# Altium project ASR-2DF.PrjPCB
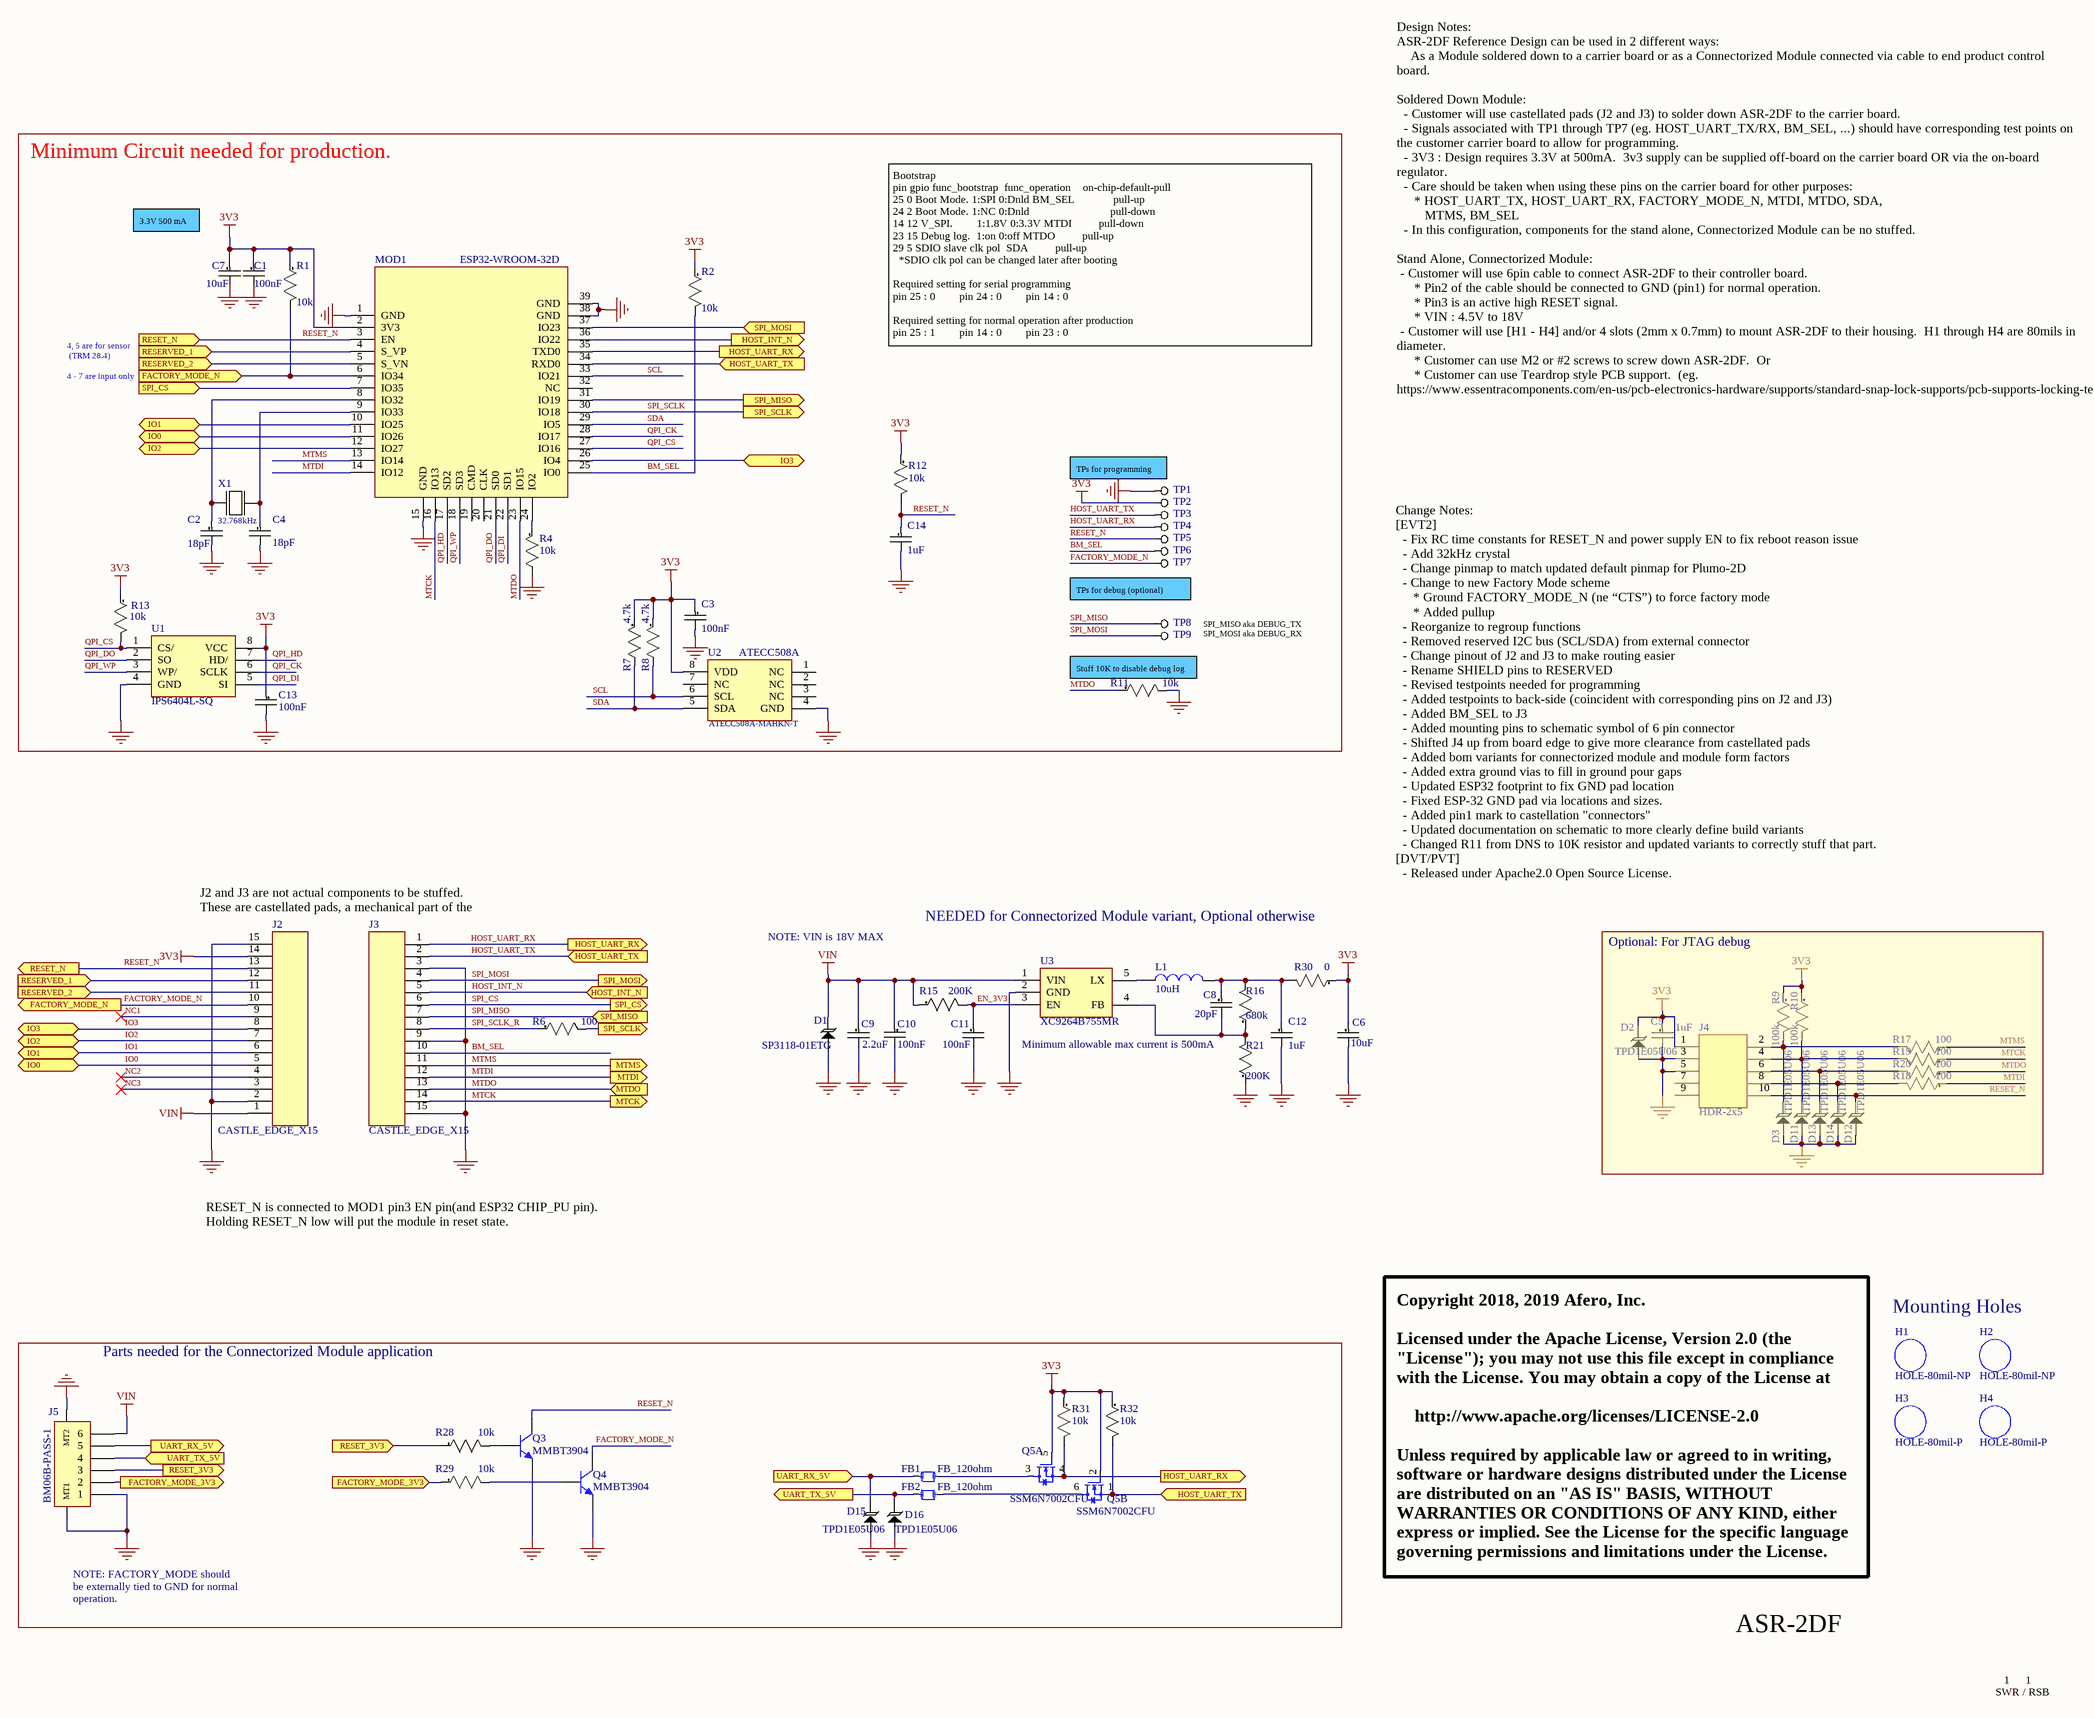
[diagram p0: ASR-2DF.SchDoc]
CompanyName: Afero, Inc.; Revision: PVT
1 sheet, 74 parts. Net scope: flat (ports and power ports of the same name join across sheets).
Board file: ASR-2DF.PcbDoc

## Sheet ASR-2DF.SchDoc
size C; CompanyName: Afero, Inc.; Revision: PVT

### Parts
C1  100nF  [0402C-GENERIC]
C2  18pF  [0402C-GENERIC]
C3  100nF  [0402C-GENERIC]
C4  18pF  [0402C-GENERIC]
C5  1uF  [0402C-GENERIC]
C6  10uF  [0603C-GENERIC]
C7  10uF  [0603C-GENERIC]
C8  20pF  [0402C-GENERIC]
C9  2.2uF  [0603C-GENERIC]
C10  100nF  [0402C-GENERIC]
C11  100nF  [0402C-GENERIC]
C12  1uF  [0402C-GENERIC]
C13  100nF  [0402C-GENERIC]
C14  1uF  [0402C-GENERIC]
D1  SP3118-01ETG  [SOD882]
D2  TPD1E05U06  [SON70P100X45-2N]
D3  TPD1E05U06  [SON70P100X45-2N]
D11  TPD1E05U06  [SON70P100X45-2N]
D12  TPD1E05U06  [SON70P100X45-2N]
D13  TPD1E05U06  [SON70P100X45-2N]
D14  TPD1E05U06  [SON70P100X45-2N]
D15  TPD1E05U06  [SON70P100X45-2N]
D16  TPD1E05U06  [SON70P100X45-2N]
FB1  FB_120ohm  [BLM15]
FB2  FB_120ohm  [BLM15]
H1  HOLE-80mil-NP  [HOLE-80mil-NP]  (no BOM)
H2  HOLE-80mil-NP  [HOLE-80mil-NP]  (no BOM)
H3  HOLE-80mil-P  [HOLE-80mil-P]  (no BOM)
H4  HOLE-80mil-P  [HOLE-80mil-P]  (no BOM)
J2  CASTLE_EDGE_X15  [CASTL-1X15]  (no BOM)
J3  CASTLE_EDGE_X15  [CASTL-1X15]  (no BOM)
J4  HDR-2x5  [S9015E-05]
J5  BM06B-PASS-1  [BM06B-PASS-1]
L1  10uH  [ASPI-0315FS]
MOD1  ESP32-WROOM-32D  [ESP32-WROOM-32D]
Q3  MMBT3904  [sot23]
Q4  MMBT3904  [sot23]
Q5  SSM6N7002CFU  [SOT363]  (parts A,B of 2)
R1  10k  [0402R-GENERIC]
R2  10k  [0402R-GENERIC]
R4  10k  [0402R-GENERIC]
R6  100  [0402R-GENERIC]
R7  4.7k  [0402R-GENERIC]
R8  4.7k  [0402R-GENERIC]
R9  100k  [0402R-GENERIC]
R10  100k  [0402R-GENERIC]
R11  10k  [0402R-GENERIC]
R12  10k  [0402R-GENERIC]
R13  10k  [0402R-GENERIC]
R15  200K  [0402R-GENERIC]
R16  680k  [0402R-GENERIC]
R17  100  [0402R-GENERIC]
R18  100  [0402R-GENERIC]
R19  100  [0402R-GENERIC]
R20  100  [0402R-GENERIC]
R21  200K  [0402R-GENERIC]
R28  10k  [0402R-GENERIC]
R29  10k  [0402R-GENERIC]
R30  0  [0402R-GENERIC]
R31  10k  [0402R-GENERIC]
R32  10k  [0402R-GENERIC]
TP1  TP1MM  [TP1MM]  (value not drawn)  (no BOM)
TP2  TP1MM  [TP1MM]  (value not drawn)  (no BOM)
TP3  TP1MM  [TP1MM]  (value not drawn)  (no BOM)
TP4  TP1MM  [TP1MM]  (value not drawn)  (no BOM)
TP5  TP1MM  [TP1MM]  (value not drawn)  (no BOM)
TP6  TP1MM  [TP1MM]  (value not drawn)  (no BOM)
TP7  TP1MM  [TP1MM]  (value not drawn)  (no BOM)
TP8  TP1MM  [TP1MM]  (value not drawn)  (no BOM)
TP9  TP1MM  [TP1MM]  (value not drawn)  (no BOM)
U1  IPS6404L-SQ  [IPUS.PSRAM]
U2  ATECC508A  Manufacturer Part Number: ATECC508A-MAHKN-T  [SON50P300X60-8N]
U3  XC9264B755MR  [SOT95P275X130-5N]
X1  32.768kHz  [ABS06]

### Blocks framed on the sheet
Minimum Circuit needed for production.: C1-C4 C7 C13 C14 MOD1 R1 R2 R4 R7 R8 R11-R13 TP1-TP9 U1 U2 X1
Optional: For JTAG debug: C5 D2 D3 D11-D14 J4 R9 R10 R17-R20
Parts needed for the Connectorized Module application: D15 D16 FB1 FB2 J5 Q3-Q5 R28 R29 R31 R32

### Ports
FACTORY_MODE_3V3, FACTORY_MODE_N, HOST_INT_N, HOST_UART_RX, HOST_UART_TX, IO0 (bidir), IO1 (bidir), IO2 (bidir), IO3 (bidir), MTCK, MTDI, MTDO, MTMS, RESERVED_1, RESERVED_2, RESET_3V3, RESET_N, SPI_CS, SPI_MISO, SPI_MISO (out), SPI_MOSI, SPI_MOSI (in), SPI_SCLK (out), UART_RX_5V, UART_TX_5V

### Nets
3V3: C1.1 C3.1 C5.1 C6.1 C7.1 C13.1 D2.1(I/O) J2.14 J4.1 MOD1.2(3V3) Q5.2(G2) Q5.5(G2) R1.1 R2.1 R7.1 R8.1 R9.1 R10.1 R12.1 R13.1 R30.1 R31.1 R32.1 TP2.1 U1.8(VCC) U2.8(VDD)
GND: C1.2 C2.2 C3.2 C4.2 C5.2 C6.2 C7.2 C9.2 C10.2 C11.2 C12.2 C13.2 C14.2 D1.2(GND) D2.2(GND) D3.2(GND) D11.2(GND) D12.2(GND) D13.2(GND) D14.2(GND) D15.2(GND) D16.2(GND) J2.2 J2.15 J3.3 J3.9 J3.15 J4.3 J4.5 J5.1 J5.7(MT1) J5.8(MT2) MOD1.1(GND) MOD1.15(GND) MOD1.38(GND) MOD1.39(GND) Q3.2(E) Q4.2(E) R4.2 R11.2 R21.1 TP1.1 U1.4(GND) U2.4(GND) U3.2(GND)
VIN: C9.1 C10.1 D1.1(I/O) J2.1 J5.6 R15.1 U3.1(VIN)
BM_SEL: J3.10 MOD1.25(IO0) R2.2 TP6.1
EN_3V3: C11.1 R15.2 U3.3(EN)
FACTORY_MODE_N: J2.10 MOD1.6(IO34) Q4.3(C) R1.2 TP7.1 ; port FACTORY_MODE_N
HOST_INT_N: J3.5 MOD1.36(IO22) ; port HOST_INT_N
HOST_UART_RX: J3.1 MOD1.35(TXD0) Q5.4(S2) R31.2 TP4.1 ; port HOST_UART_RX
HOST_UART_TX: J3.2 MOD1.34(RXD0) Q5.1(S2) R32.2 TP3.1 ; port HOST_UART_TX
IO0: J2.5 MOD1.11(IO26) ; port IO0
IO1: J2.6 MOD1.10(IO25) ; port IO1
IO2: J2.7 MOD1.12(IO27) ; port IO2
IO3: J2.8 MOD1.26(IO4) ; port IO3
MTCK: J3.14 MOD1.16(IO13) R19.1 ; port MTCK
MTDI: J3.12 MOD1.14(IO12) R18.1 ; port MTDI
MTDO: J3.13 MOD1.23(IO15) R11.1 R20.1 ; port MTDO
MTMS: J3.11 MOD1.13(IO14) R17.1 ; port MTMS
NC1: J2.9
NC2: J2.4
NC3: J2.3
QPI_CK: MOD1.28(IO17) U1.6(SCLK)
QPI_CS: MOD1.27(IO16) R13.2 U1.1(CS/)
QPI_DI: MOD1.22(SD1) U1.5(SI)
QPI_DO: MOD1.21(SD0) U1.2(SO)
QPI_HD: MOD1.17(SD2) U1.7(HD/)
QPI_WP: MOD1.18(SD3) U1.3(WP/)
RESET_N: C14.1 D12.1(I/O) J2.13 J4.10 MOD1.3(EN) Q3.3(C) R12.2 TP5.1 ; port RESET_N
SCL: MOD1.33(IO21) R8.2 U2.6(SCL)
SDA: MOD1.29(IO5) R7.2 U2.5(SDA)
SPI_CS: J3.6 MOD1.7(IO35) ; port SPI_CS
SPI_MISO: J3.7 MOD1.31(IO19) TP8.1 ; port SPI_MISO
SPI_MOSI: J3.4 MOD1.37(IO23) TP9.1 ; port SPI_MOSI
SPI_SCLK: MOD1.30(IO18) R6.2 ; port SPI_SCLK
SPI_SCLK_R: J3.8 R6.1
NetC2_1: C2.1 MOD1.8(IO32) X1.2
NetC4_1: C4.1 MOD1.9(IO33) X1.1
NetC8_1: C8.1 C12.1 L1.2 R16.2 R30.2
NetC8_2: C8.2 R16.1 R21.2 U3.4(FB)
NetD3_1: D3.1(I/O) J4.2 R9.2 R17.2
NetD11_1: D11.1(I/O) J4.4 R10.2 R19.2
NetD13_1: D13.1(I/O) J4.6 R20.2
NetD14_1: D14.1(I/O) J4.8 R18.2
NetD15_1: D15.1(I/O) FB1.1 J5.5 ; port UART_RX_5V
NetD16_1: D16.1(I/O) FB2.1 J5.4 ; port UART_TX_5V
NetFB1_2: FB1.2 Q5.3(D2)
NetFB2_2: FB2.2 Q5.6(D2)
NetJ2_11: J2.11 MOD1.5(S_VN) ; port RESERVED_2
NetJ2_12: J2.12 MOD1.4(S_VP) ; port RESERVED_1
NetJ5_2: J5.2 R29.1 ; port FACTORY_MODE_3V3
NetJ5_3: J5.3 R28.1 ; port RESET_3V3
NetL1_1: L1.1 U3.5(LX)
NetMOD1_24: MOD1.24(IO2) R4.1
NetQ3_1: Q3.1(B) R28.2
NetQ4_1: Q4.1(B) R29.2

Not connected (* = marked no-connect by the designer): J4 7 9; MOD1 19(CMD) 20(CLK) 32(NC); U2 1(NC) 2(NC) 3(NC) 7(NC)

### Notes on the sheet
- 3.3V 500 mA
- 4, 5 are for sensor
  (TRM 28.4)
- Bootstrap
  pin	gpio	func_bootstrap		func_operation    on-chip-default-pull
  25	0	Boot Mode. 1:SPI 0:Dnld	BM_SEL             pull-up
  24	2	Boot Mode. 1:NC 0:Dnld	                          pull-down
  14	12	V_SPI.        1:1.8V 0:3.3V	MTDI	        pull-down
  23	15	Debug log.  1:on 0:off	MTDO	        pull-up
  29	5	SDIO slave clk pol		SDA	        pull-up
  *SDIO clk pol can be changed later after booting
  Required setting for serial programming
  pin 25 : 0        pin 24 : 0        pin 14 : 0
  Required setting for normal operation after production
  pin 25 : 1        pin 14 : 0        pin 23 : 0
- 4 - 7 are input only
- Design Notes:
  ASR-2DF Reference Design can be used in 2 different ways:
  As a Module soldered down to a carrier board or as a Connectorized Module connected via cable to end product control board.
  Soldered Down Module:
  - Customer will use castellated pads (J2 and J3) to solder down ASR-2DF to the carrier board.
  - Signals associated with TP1 through TP7 (eg. HOST_UART_TX/RX, BM_SEL, ...) should have corresponding test points on the customer carrier board to allow for programming.
  - 3V3 : Design requires 3.3V at 500mA.  3v3 supply can be supplied off-board on the carrier board OR via the on-board regulator.
  - Care should be taken when using these pins on the carrier board for other purposes:
  * HOST_UART_TX, HOST_UART_RX, FACTORY_MODE_N, MTDI, MTDO, SDA,
  MTMS, BM_SEL
  - In this configuration, components for the stand alone, Connectorized Module can be no stuffed.
  Stand Alone, Connectorized Module:
  - Customer will use 6pin cable to connect ASR-2DF to their controller board.
  * Pin2 of the cable should be connected to GND (pin1) for normal operation.
  * Pin3 is an active high RESET signal.
  * VIN : 4.5V to 18V
  - Customer will use [H1 - H4] and/or 4 slots (2mm x 0.7mm) to mount ASR-2DF to their housing.  H1 through H4 are 80mils in diameter.
  * Customer can use M2 or #2 screws to screw down ASR-2DF.  Or
  * Customer can use Teardrop style PCB support.  (eg. https://www.essentracomponents.com/en-us/pcb-electronics-hardware/supports/standard-snap-lock-supports/pcb-supports-locking-teardrop/mdlsp3-1-01)
- (near TP1) TPs for programming
- TPs for debug (optional)
- Stuff 10K to disable debug log
- SPI_MISO aka DEBUG_TX
  SPI_MOSI aka DEBUG_RX
- J2 and J3 are not actual components to be stuffed.
  These are castellated pads, a mechanical part of the board.
- Change Notes:
  [EVT2]
  - Fix RC time constants for RESET_N and power supply EN to fix reboot reason issue
  - Add 32kHz crystal
  - Change pinmap to match updated default pinmap for Plumo-2D
  - Change to new Factory Mode scheme
  * Ground FACTORY_MODE_N (ne “CTS”) to force factory mode
  * Added pullup
  - Reorganize to regroup functions
  - Removed reserved I2C bus (SCL/SDA) from external connector
  - Change pinout of J2 and J3 to make routing easier
  - Rename SHIELD pins to RESERVED
  - Revised testpoints needed for programming
  - Added testpoints to back-side (coincident with corresponding pins on J2 and J3)
  - Added BM_SEL to J3
  - Added mounting pins to schematic symbol of 6 pin connector
  - Shifted J4 up from board edge to give more clearance from castellated pads
  - Added bom variants for connectorized module and module form factors
  - Added extra ground vias to fill in ground pour gaps
  - Updated ESP32 footprint to fix GND pad location
  - Fixed ESP-32 GND pad via locations and sizes.
  - Added pin1 mark to castellation "connectors"
  - Updated documentation on schematic to more clearly define build variants
  - Changed R11 from DNS to 10K resistor and updated variants to correctly stuff that part.
  [DVT/PVT]
  - Released under Apache2.0 Open Source License.
- NOTE: VIN is 18V MAX
- NEEDED for Connectorized Module variant, Optional otherwise
- Minimum allowable max current is 500mA
- RESET_N is connected to MOD1 pin3 EN pin(and ESP32 CHIP_PU pin).
  Holding RESET_N low will put the module in reset state.
- Mounting Holes
- Copyright 2018, 2019 Afero, Inc.
  Licensed under the Apache License, Version 2.0 (the "License"); you may not use this file except in compliance with the License. You may obtain a copy of the License at
  http://www.apache.org/licenses/LICENSE-2.0
  Unless required by applicable law or agreed to in writing, software or hardware designs distributed under the License are distributed on an "AS IS" BASIS, WITHOUT WARRANTIES OR CONDITIONS OF ANY KIND, either express or implied. See the License for the specific language governing permissions and limitations under the License.
- NOTE: FACTORY_MODE should be externally tied to GND for normal operation.
- ASR-2DF
- SWR / RSB
- 1

### Library data of the parts
C1 C3 C10 C11 C13 = 0402C-100n: Capacitor 100nF X5R 50V 10% 0402; Manufacturer: Murata; Manufacturer Part Number: GRM155R61H104KE19D; item_number: E-CAP-00090-00; Supplier 1: Mouser; Stock 1: 727844; Pricing 1: 1=0.1, 10=0.068, 50=0.068, 100=0.03, 1000=0.017, 10000=0.011 (USD); Mount: Surface Mount; Case/Package: 0402; Case Code (Metric): 1005; Case Code (Imperial): 0402; Min Operating Temperature: -55°C; Max Operating Temperature: 85°C; Packaging: Tape and Reel; Capacitance: 100nF; Tolerance: 10%; Voltage Rating: 50V; Dielectric: X5R; Voltage: 50V; Voltage Rating (DC): 50V; Length: 1mm; Height: 0.5mm; Width: 0.02inch; Thickness: 0.022inch; Depth: 0.5mm; REACH SVHC: No SVHC; Lead Free: Lead Free; Supplier Part Number 1: 81-GRM155R61H104KE9D
C2 C4 = 0402C-18p: Capacitor, 18pF, 50V, 1%, C0G; Manufacturer: Murata; Manufacturer Part Number: GJM1555C1H180FB01D; item_number: E-CAP-00110-00; Mount: Surface Mount; Case/Package: 0402; Case Code (Metric): 1005; Case Code (Imperial): 0402; Min Operating Temperature: -55°C; Max Operating Temperature: 125°C; Capacitance: 18pF; Tolerance: 1%; Voltage Rating: 50V; Voltage Rating (DC): 50V; Packaging: Tape and Reel; Package Quantity: 10000; Dielectric: C0G; Termination: SMD/SMT; Length: 1mm; Height: 0.5mm; Width: 0.02inch; Thickness: 0.022inch; Depth: 0.5mm; Radiation Hardening: No; REACH SVHC: No SVHC; Lead Free: Lead Free
C5 C12 C14 = 0402C-1u: Capacitor 1uF X5R 6.3V 20% 0402; Manufacturer: SEM; Manufacturer Part Number: CL05A105KQ5NNNC; Type: Chip Monolithic Ceramic Capacitor; Voltage Rating DC: 6.3 VDC; Capacitance - nF: 1000 nF; Value: 1u; item_number: E-CAP-00020-00; RoHS: RoHS Compliant; Category: Multilayer Ceramic Capacitors MLCC - SMD/SMT; Capacitance: 1uF; Height: 0.5 mm; Length: 1 mm; Package / Case: 0402 (1005 metric); Packaging: Cut Tape; Product: General Type MLCCs; Series: GRM; Termination Style: SMD/SMT; Tolerance: 20 %; Width: 0.5 mm; Brand: SEM; Case Code - in: 0402; Case Code - mm: 1005; Dielectric: X5R; Maximum Operating Temperature: + 85 C; Minimum Operating Temperature: - 55 C; Standard Pack Qty: 50000; RoHS - Mouser: Y; Minimum Order Quantity: 1; Reeling: True
C6 C7 = 0603C-10u: Capacitor 10uF X5R 16V 20% 0603; Manufacturer: Murata; Manufacturer Part Number: GRM188R61C106MA73D; Value: 10u; Material: Ceramic; item_number: E-CAP-00100-00; Mount: Surface Mount; Case/Package: 0603; Weight: 0.000222oz; Case Code (Metric): 1608; Case Code (Imperial): 0603; Min Operating Temperature: -55°C; Max Operating Temperature: 85°C; Capacitance: 10uF; Tolerance: 20%; Packaging: Tape and Reel; Dielectric: X5R; Voltage Rating: 16V; Termination: SMD/SMT; Voltage Rating (DC): 16V; Package Quantity: 4000; Length: 1.6mm; Height: 1mm; Width: 0.8mm; Thickness: 0.037inch; Depth: 0.8mm; REACH SVHC: No SVHC; Lead Free: Lead Free
C8 = 0402C-20p: Capacitor 20pF C0G 50V 1% 0402; Manufacturer: Murata; Manufacturer Part Number: GJM1555C1H200FB01D; item_number: E-CAP-00107-00; Mount: Surface Mount; Case/Package: 0402; Case Code (Metric): 1005; Case Code (Imperial): 0402; Min Operating Temperature: -55°C; Max Operating Temperature: 125°C; Capacitance: 20pF; Tolerance: 1%; Voltage Rating: 50V; Voltage Rating (DC): 50V; Packaging: Tape and Reel; Package Quantity: 10000; Dielectric: C0G; Termination: SMD/SMT; Length: 1mm; Height: 0.5mm; Width: 0.02inch; Thickness: 0.022inch; Depth: 0.5mm; Radiation Hardening: No; REACH SVHC: No SVHC; Lead Free: Lead Free
C9 = 0603C-2u2: Capacitor 2.2uF X5R 25V 10% 0603; Manufacturer: Murata; Manufacturer Part Number: GRM188R61E225KA12D; Value: 2u2; Material: Ceramic; item_number: E-CAP-00108-00; Mount: Surface Mount; Case/Package: 0603; Weight: 0.000222oz; Case Code (Metric): 1608; Case Code (Imperial): 0603; Min Operating Temperature: -55°C; Max Operating Temperature: 85°C; Capacitance: 2.2uF; Tolerance: 10%; Packaging: Tape and Reel; Dielectric: X5R; Voltage Rating: 25V; Termination: SMD/SMT; Voltage Rating (DC): 25V; Package Quantity: 4000; Length: 1.6mm; Height: 0.9mm; Width: 0.8mm; Thickness: 0.037inch; Depth: 0.8mm; REACH SVHC: No SVHC; Lead Free: Lead Free
D1 = SP3118-01ETG: Diode TVS; Manufacturer: Littelfuse; Number of Channels: 1; Operating Supply Voltage: 18V; Capacitance: 0.3pF; Direction: Bidirectional; Clamping Voltage: 38V; Peak Pulse Power: 76W; Power Line Protection: Yes; Leakage Current: 50nA; Element Configuration: Single; Peak Pulse Current: 2A; item_number: E-DIO-00011-00; Manufacturer Part Number: SP3118-01ETG; Mount: Surface Mount; Number of Pins: 2; Min Operating Temperature: -40°C; Max Operating Temperature: 125°C; Package Quantity: 10000; Packaging: Tape and Reel; Number of Bidirectional Channels: 1; Min Breakdown Voltage: -; Reverse Standoff Voltage: 18V; Termination: SMD/SMT; Polarity: Bidirectional; Working Voltage: 18V; Max Power Dissipation: 76W; Length: 1mm; Radiation Hardening: No; Lead Free: Lead Free; REACH SVHC: No SVHC
D2 D3 D11-D16 = TPD1E05U06: Diode TVS; Manufacturer: Texas Instruments; Manufacturer Part Number: TPD1E05U06DPYR; Number of Channels: 1; Interface: LVDS,USB,Ethernet,HDMI,PCIe,SATA; Operating Supply Voltage: 5.5V; Capacitance: 0.5pF; Direction: Unidirectional; Min Breakdown Voltage: 6V; Clamping Voltage: 14V; Peak Pulse Power: 40W; Power Line Protection: Yes; Breakdown Voltage: 6.5V; Polarity: Bidirectional; Leakage Current: 10nA; Element Configuration: Single; Peak Pulse Current: 2.5A; item_number: E-DIO-00008-00; Supplier 1: Digi-Key; Supplier Part Number 1: 296-39341-1-ND; Stock 1: 161045; Pricing 1: 1=0.5, 10=0.372, 100=0.2107, 500=0.1395, 1000=0.107 (USD); Mount: Surface Mount; Number of Pins: 2; Min Operating Temperature: -40°C; Max Operating Temperature: 125°C; Package Quantity: 10000; Packaging: Tape and Reel; Number of Bidirectional Channels: 1; Reverse Standoff Voltage: 5.5V; Termination: SMD/SMT; Working Voltage: 5.5V; Max Power Dissipation: 40W; Length: 1.1mm; Radiation Hardening: No; Lead Free: Lead Free; REACH SVHC: No SVHC; ComponentLink1URL: https://datasheet.ciiva.com/12545/tpd1e05u06-224685-12545140.pdf; ComponentLink1Description: https://datasheet.ciiva.com/12545/tpd1e05u06-224685-12545140.pdf; ComponentLink2URL: https://datasheet.ciiva.com/26918/getdatasheetpartid-700473-26918022.pdf; ComponentLink2Description: https://datasheet.ciiva.com/26918/getdatasheetpartid-700473-26918022.pdf; ComponentLink3URL: https://datasheet.ciiva.com/6574/tpd1e05u06-6574667.pdf; ComponentLink3Description: https://datasheet.ciiva.com/6574/tpd1e05u06-6574667.pdf
FB1 FB2 = FB_120ohm: FERRITE BEAD 120OHM 0402 1LN; Manufacturer: Murata; Manufacturer Part Number: BLM15AG121SN1D; CLASS: DISCRETE; item_number: E-IND-00038-00
H1 H2 = HOLE-80mil-NP: 0.08" Unplated Hole with 0.1" keepout, #2 screw
H3 H4 = HOLE-80mil-P: 0.08" Plated Hole, #2 screw
J2 J3 = CASTLE_EDGE_X15: 0.07" castellated board edge connector 15 positions
J4 = HDR-2x5: .050 Male Header 2x5; Manufacturer Part Number: GRPB052VWVN-RC; item_number: M-CON-00016-00
J5 = BM06B-PASS-1: JST PA-Family Vertical Header 2mm; Manufacturer Part Number: BM06B-PASS-1-TFT; item_number: M-CON-00088; Manufacturer: JST
L1 = ASPI-0315FS-100M: Inductor 10uH 1.1A 0.22ohm 20% 3x3; Manufacturer: Abracon; item_number: E-IND-00043-00; Value: 10uH; Manufacturer Part Number: ASPI-0315FS-100M
MOD1 = ESP32-WROOM-32D: Module WIFI BLE ESP32-D0WD SPI Flash; Manufacturer: Espressif; Item_number: E-ICS-00097-00; Size: 25.5mm x 18mm; Manufacturer Part Number: ESP32-WROOM-32D
Q3 Q4 = MMBT3904: TR NPN BJT 200mA 40V; Manufacturer Part Number: MMBT3904LT1G; Manufacturer: On Semiconductor; item_number: E-TRS-00002-00; ComponentLink1Description: Manufacturer Link; ComponentLink1URL: http://www.fairchildsemi.com/; ComponentLink2Description: Datasheet; ComponentLink2URL: http://www.fairchildsemi.com/ds/2N%2F2N3904.pdf; Package/Case: SOT23
Q5 = SSM6N7002CFU: TR 2xNFET 170mA 60V; Manufacturer Part Number: SSM6N7002CFU.LF; Manufacturer: Toshiba; item_number: E-TRS-00009-00; Case/Package: SOT-363
R1 R2 R4 R12 R13 R28 R29 R31 R32 = 0402R-10k: Resistor 10K 50V 5% 0402; Manufacturer: Vishay Dale; Manufacturer Part Number: CRCW040210K0JNED; Power Rating: 63mW; Temperature Coefficient: 200ppm/°C; item_number: E-RES-00001-00; Supplier 1: Digi-Key; Supplier Part Number 1: 541-10KJCT-ND; Stock 1: 0; Pricing 1: 1=0.1, 10=0.031, 100=0.0125, 1000=0.0056, 2500=0.0049, 5000=0.004 (USD); Mount: Surface Mount; Case/Package: 0402; Weight: 2.3E-05oz; Case Code (Imperial): 0402; Case Code (Metric): 1005; Contact Plating: Tin; Min Operating Temperature: -55°C; Max Operating Temperature: 155°C; Resistance: 10k; Tolerance: 5%; Packaging: Tape and Reel; Termination: SMD/SMT; Package Quantity: 1; Voltage Rating: 50V; Composition: Thick Film; Military Standard: Not; Number of Terminations: 2; Max Power Dissipation: 63mW; Features: Automotive AEC-Q200; Length: 1mm; Height: 0.016inch; Depth: 0.5mm; Width: 0.5mm; Radiation Hardening: No; REACH SVHC: Unknown; ComponentLink1URL: https://datasheet.ciiva.com/2461/dcrcwe3-2461974.pdf; ComponentLink1Description: https://datasheet.ciiva.com/2461/dcrcwe3-2461974.pdf; ComponentLink2URL: https://datasheet.ciiva.com/2461/dcrcwe3-2461975.pdf; ComponentLink2Description: https://datasheet.ciiva.com/2461/dcrcwe3-2461975.pdf; ComponentLink3URL: https://datasheet.ciiva.com/2461/dcrcwe3-2461976.pdf; ComponentLink3Description: https://datasheet.ciiva.com/2461/dcrcwe3-2461976.pdf; ComponentLink4URL: https://datasheet.ciiva.com/7743/dcrcwe3-7743416.pdf; ComponentLink4Description: https://datasheet.ciiva.com/7743/dcrcwe3-7743416.pdf; ComponentLink5URL: https://datasheet.ciiva.com/16771/70201119-16771096.pdf; ComponentLink5Description: https://datasheet.ciiva.com/16771/70201119-16771096.pdf; ComponentLink6URL: https://datasheet.ciiva.com/7743/dcrcwe3-7743417.pdf; ComponentLink6Description: https://datasheet.ciiva.com/7743/dcrcwe3-7743417.pdf; ComponentLink7URL: https://datasheet.ciiva.com/16761/70201119-16761947.pdf; ComponentLink7Description: https://datasheet.ciiva.com/16761/70201119-16761947.pdf; ComponentLink8URL: https://datasheet.ciiva.com/3255/dcrcwe3-3255964.pdf; ComponentLink8Description: https://datasheet.ciiva.com/3255/dcrcwe3-3255964.pdf; ComponentLink9URL: https://datasheet.ciiva.com/3255/dcrcwe3-3255965.pdf; ComponentLink9Description: https://datasheet.ciiva.com/3255/dcrcwe3-3255965.pdf
R6 R17-R20 = 0402R-100R: Resistor 100R 50V 5% 0402; Manufacturer: Panasonic; Manufacturer Part Number: ERJ-2GEJ101X; Temperature Coefficient: 100ppm/°C; Power Rating: 100mW; item_number: E-RES-00008-00; Pricing 1: 1=0.1, 10=0.044, 100=0.0178, 1000=0.008, 2500=0.007, 5000=0.0058 (USD); Mount: Surface Mount; Case/Package: 0402; Weight: 2.3E-05oz; Case Code (Metric): 1005; Case Code (Imperial): 0402; Contact Plating: Tin; Min Operating Temperature: -55°C; Max Operating Temperature: 155°C; Resistance: 100; Tolerance: 5%; Packaging: Tape and Reel; Voltage Rating (DC): 50V; Voltage Rating: 50V; Termination: SMD/SMT; Package Quantity: 10; Composition: Thick Film; Number of Terminations: 2; Military Standard: Not; Max Power Dissipation: 100mW; Features: Automotive AEC-Q200; Working Voltage: 50V; Length: 1mm; Height: 0.35mm; Width: 0.02inch; Depth: 0.5mm; Radiation Hardening: No; REACH SVHC: Unknown; Lead Free: Lead Free
R7 R8 = 0402R-4k7: Resistor 4.7K 50V 5% 0402; Manufacturer: Panasonic; Manufacturer Part Number: ERJ-2GEJ472X; Temperature Coefficient: 200ppm/°C; Power Rating: 100mW; item_number: E-RES-00039-00; Supplier 1: Digi-Key; Supplier Part Number 1: P4.7KJCT-ND; Stock 1: 10404054; Pricing 1: 1=0.1, 10=0.038, 100=0.0154, 1000=0.0069, 2500=0.006, 5000=0.005 (USD); Mount: Surface Mount; Case/Package: 0402; Case Code (Imperial): 0402; Case Code (Metric): 1005; Contact Plating: Tin; Min Operating Temperature: -55°C; Max Operating Temperature: 155°C; Resistance: 4.7k; Tolerance: 5%; Voltage Rating: 50V; Packaging: Cut Tape; Termination: SMD/SMT; Military Standard: Not; Package Quantity: 1; Composition: Thick Film; Number of Terminations: 2; Max Power Dissipation: 100mW; Voltage Rating (DC): 50V; Features: Automotive AEC-Q200; Length: 1mm; Height: 0.35mm; Width: 0.5mm; Depth: 0.5mm; Radiation Hardening: No; REACH SVHC: No SVHC; Lead Free: Lead Free; ComponentLink1URL: https://datasheet.ciiva.com/11821/0900766b80f806dd-11821328.pdf; ComponentLink1Description: https://datasheet.ciiva.com/11821/0900766b80f806dd-11821328.pdf; ComponentLink2URL: https://datasheet.ciiva.com/16758/70260739-16758341.pdf; ComponentLink2Description: https://datasheet.ciiva.com/16758/70260739-16758341.pdf; ComponentLink3URL: https://datasheet.ciiva.com/16770/70260739-16770309.pdf; ComponentLink3Description: https://datasheet.ciiva.com/16770/70260739-16770309.pdf; ComponentLink4URL: https://datasheet.ciiva.com/28514/1678796-28514168.pdf; ComponentLink4Description: https://datasheet.ciiva.com/28514/1678796-28514168.pdf; ComponentLink5URL: https://datasheet.ciiva.com/17213/aoa0000ce1-17213178.pdf; ComponentLink5Description: https://datasheet.ciiva.com/17213/aoa0000ce1-17213178.pdf; ComponentLink6URL: https://datasheet.ciiva.com/16523/aoa0000ce1-16523499.pdf; ComponentLink6Description: https://datasheet.ciiva.com/16523/aoa0000ce1-16523499.pdf; ComponentLink7URL: https://datasheet.ciiva.com/46377/1678796-46377565.pdf; ComponentLink7Description: https://datasheet.ciiva.com/46377/1678796-46377565.pdf
R9 R10 = 0402R-100k: Resistor 100K 50V 5% 0402; Manufacturer: Panasonic; Manufacturer Part Number: ERJ-2GEJ104X; Power Rating: 100mW; Temperature Coefficient: 200ppm/°C; item_number: E-RES-00012-00; Supplier 1: Digi-Key; Supplier Part Number 1: P100KJCT-ND; Stock 1: 10583442; Pricing 1: 1=0.1, 10=0.038, 100=0.0154, 1000=0.0069, 2500=0.006, 5000=0.005 (USD); Mount: Surface Mount; Case/Package: 0402; Case Code (Imperial): 0402; Case Code (Metric): 1005; Contact Plating: Tin; Min Operating Temperature: -55°C; Max Operating Temperature: 155°C; Resistance: 100k; Tolerance: 5%; Packaging: Tape and Reel; Termination: SMD/SMT; Package Quantity: 1; Voltage Rating: 50V; Composition: Thick Film; Military Standard: Not; Number of Terminations: 2; Max Power Dissipation: 100mW; Features: Automotive AEC-Q200; Length: 1mm; Height: 0.35mm; Depth: 0.5mm; Width: 0.02inch; Radiation Hardening: No; REACH SVHC: No SVHC; ComponentLink1URL: https://datasheet.ciiva.com/11821/0900766b80f806dd-11821174.pdf; ComponentLink1Description: https://datasheet.ciiva.com/11821/0900766b80f806dd-11821174.pdf; ComponentLink2URL: https://datasheet.ciiva.com/22758/1500035-22758198.pdf; ComponentLink2Description: https://datasheet.ciiva.com/22758/1500035-22758198.pdf; ComponentLink3URL: https://datasheet.ciiva.com/34303/1986799-34303543.pdf; ComponentLink3Description: https://datasheet.ciiva.com/34303/1986799-34303543.pdf; ComponentLink4URL: https://datasheet.ciiva.com/24023/aoa0000ce1-37422-24023480.pdf; ComponentLink4Description: https://datasheet.ciiva.com/24023/aoa0000ce1-37422-24023480.pdf; ComponentLink5URL: https://datasheet.ciiva.com/16777/70260739-16777321.pdf; ComponentLink5Description: https://datasheet.ciiva.com/16777/70260739-16777321.pdf; ComponentLink6URL: https://datasheet.ciiva.com/16759/70260739-16759692.pdf; ComponentLink6Description: https://datasheet.ciiva.com/16759/70260739-16759692.pdf; ComponentLink7URL: https://datasheet.ciiva.com/48531/aoa0000ce1-48531084.pdf; ComponentLink7Description: https://datasheet.ciiva.com/48531/aoa0000ce1-48531084.pdf; ComponentLink8URL: https://datasheet.ciiva.com/9186/aoa0000ce1-9186685.pdf; ComponentLink8Description: https://datasheet.ciiva.com/9186/aoa0000ce1-9186685.pdf; ComponentLink9URL: https://datasheet.ciiva.com/30204/4aoa0000ce1-30204557.pdf; ComponentLink9Description: https://datasheet.ciiva.com/30204/4aoa0000ce1-30204557.pdf; Voltage Rating (DC): 50V; Lead Free: Lead Free; ComponentLink10URL: https://datasheet.ciiva.com/46389/1500035-46389645.pdf; ComponentLink10Description: https://datasheet.ciiva.com/46389/1500035-46389645.pdf
R11 = 0402R-10k: Resistor 10K 50V 5% 0402; Manufacturer: Vishay Dale; Manufacturer Part Number: CRCW040210K0JNED; item_number: E-RES-00001-00; Power Rating: 63mW; Temperature Coefficient: 200ppm/°C; Case/Package: 0402; Contact Plating: Tin; Case Code (Imperial): 0402; Case Code (Metric): 1005; Min Operating Temperature: -55°C; Max Operating Temperature: 155°C; Resistance: 10k; Composition: Thick Film; Tolerance: 5%; Termination: SMD/SMT; Length: 1mm; Height: 0.016inch; Width: 0.5mm; Radiation Hardening: No; Supplier 1: Digi-Key; Supplier Part Number 1: 541-10KJCT-ND; Stock 1: 0; Pricing 1: 1=0.1, 10=0.031, 100=0.0125, 1000=0.0056, 2500=0.0049, 5000=0.004 (USD); Mount: Surface Mount; Weight: 2.3E-05oz; Packaging: Tape and Reel; Package Quantity: 1; Voltage Rating: 50V; Military Standard: Not; Number of Terminations: 2; Max Power Dissipation: 63mW; Features: Automotive AEC-Q200; Depth: 0.5mm; REACH SVHC: Unknown; ComponentLink1URL: https://datasheet.ciiva.com/2461/dcrcwe3-2461974.pdf; ComponentLink1Description: https://datasheet.ciiva.com/2461/dcrcwe3-2461974.pdf; ComponentLink2URL: https://datasheet.ciiva.com/2461/dcrcwe3-2461975.pdf; ComponentLink2Description: https://datasheet.ciiva.com/2461/dcrcwe3-2461975.pdf; ComponentLink3URL: https://datasheet.ciiva.com/2461/dcrcwe3-2461976.pdf; ComponentLink3Description: https://datasheet.ciiva.com/2461/dcrcwe3-2461976.pdf; ComponentLink4URL: https://datasheet.ciiva.com/7743/dcrcwe3-7743416.pdf; ComponentLink4Description: https://datasheet.ciiva.com/7743/dcrcwe3-7743416.pdf; ComponentLink5URL: https://datasheet.ciiva.com/16771/70201119-16771096.pdf; ComponentLink5Description: https://datasheet.ciiva.com/16771/70201119-16771096.pdf; ComponentLink6URL: https://datasheet.ciiva.com/7743/dcrcwe3-7743417.pdf; ComponentLink6Description: https://datasheet.ciiva.com/7743/dcrcwe3-7743417.pdf; ComponentLink7URL: https://datasheet.ciiva.com/16761/70201119-16761947.pdf; ComponentLink7Description: https://datasheet.ciiva.com/16761/70201119-16761947.pdf; ComponentLink8URL: https://datasheet.ciiva.com/3255/dcrcwe3-3255964.pdf; ComponentLink8Description: https://datasheet.ciiva.com/3255/dcrcwe3-3255964.pdf; ComponentLink9URL: https://datasheet.ciiva.com/3255/dcrcwe3-3255965.pdf; ComponentLink9Description: https://datasheet.ciiva.com/3255/dcrcwe3-3255965.pdf
R15 R21 = 0402R-200k: Resistor 200K 50V 1% 0402; Manufacturer: Panasonic; Manufacturer Part Number: ERJ-2RKF2003X; Power Rating: 100mW; Temperature Coefficient: 200ppm/°C; item_number: E-RES-00054-00; Mount: Surface Mount; Case/Package: 0402; Case Code (Metric): 1005; Case Code (Imperial): 0402; Contact Plating: Tin; Min Operating Temperature: -55°C; Max Operating Temperature: 155°C; Resistance: 200K; Tolerance: 1%; Packaging: Tape and Reel; Termination: SMD/SMT; Package Quantity: 1; Voltage Rating: 50V; Composition: Thick Film; Max Power Dissipation: 100mW; Number of Terminations: 2; Military Standard: Not; Voltage Rating (DC): 50V; Features: Automotive AEC-Q200; Length: 1mm; Height: 0.35mm; Depth: 0.5mm; Width: 0.02inch; Radiation Hardening: No; REACH SVHC: No SVHC; Lead Free: Lead Free
R16 = 0402R-680k: Resistor 680K 50V 5% 0402; Manufacturer: Panasonic; Manufacturer Part Number: ERJ-2GEJ684X; Power Rating: 100mW; Temperature Coefficient: 200ppm/°C; item_number: E-RES-00093-00; Supplier 1: Digi-Key; Supplier Part Number 1: P100KJCT-ND; Stock 1: 10583442; Mount: Surface Mount; Case/Package: 0402; Case Code (Metric): 1005; Case Code (Imperial): 0402; Contact Plating: Tin; Min Operating Temperature: -55°C; Max Operating Temperature: 155°C; Resistance: 680k; Tolerance: 5%; Packaging: Tape and Reel; Termination: SMD/SMT; Package Quantity: 1; Voltage Rating: 50V; Composition: Thick Film; Max Power Dissipation: 100mW; Number of Terminations: 2; Military Standard: Not; Voltage Rating (DC): 50V; Features: Automotive AEC-Q200; Length: 1mm; Height: 0.35mm; Depth: 0.5mm; Width: 0.02inch; Radiation Hardening: No; REACH SVHC: No SVHC; Lead Free: Lead Free
R30 = 0402R-0R0: Resistor 0R 50V 1% 0402; Manufacturer: Yageo; Manufacturer Part Number: RC0402FR-070RL; Resistance: 0mR; Power Rating: 62.5mW; Temperature Coefficient: 200ppm/°C; item_number: E-RES-00006-00; Supplier 1: Mouser; Supplier Part Number 1: 603-RC0402FR-070RL; Stock 1: 240535; Pricing 1: 1=0.1, 10=0.01, 50=0.01, 100=0.003, 1000=0.002, 10000=0.002 (USD); Case/Package: 0402; Contact Plating: Tin,Matte; Case Code (Imperial): 0402; Case Code (Metric): 1005; Min Operating Temperature: -55°C; Max Operating Temperature: 155°C; Composition: Thick Film; Tolerance: 1%; Packaging: Tape and Reel; Voltage Rating: 50V; Termination: SMD/SMT; Length: 1mm; Height: 0.35mm; Width: 0.5mm; Radiation Hardening: No; Lead Free: Lead Free; ComponentLink1URL: https://datasheet.ciiva.com/8896/pyu-rc0402-51-rohs-l-6-8896149.pdf; ComponentLink1Description: https://datasheet.ciiva.com/8896/pyu-rc0402-51-rohs-l-6-8896149.pdf; ComponentLink2URL: https://datasheet.ciiva.com/16790/pyu-rc0402-51-rohs-l-6-r-16790444.pdf; ComponentLink2Description: https://datasheet.ciiva.com/16790/pyu-rc0402-51-rohs-l-6-r-16790444.pdf; ComponentLink3URL: https://datasheet.ciiva.com/28419/pyu-rc0402-51-rohs-l-6-28419661.pdf; ComponentLink3Description: https://datasheet.ciiva.com/28419/pyu-rc0402-51-rohs-l-6-28419661.pdf; ComponentLink4URL: https://datasheet.ciiva.com/16869/pyu-rc0402-51-rohs-l-6-16869518.pdf; ComponentLink4Description: https://datasheet.ciiva.com/16869/pyu-rc0402-51-rohs-l-6-16869518.pdf; Value: 0
TP1-TP9 = TP1MM: 1mm Test Point; item_number: =item_name
U1 = IPS6404L-SQ: Memory SPI/QPI PSRAM 8MB SOIC8 150mil; Manufacturer: IPUS; Manufacturer Part Number: IPS6404L-SQ-SPN; item_number: E-ICS-00099-00; Package / Case: 8 SOIC 150mil
U2 = ATECC508A: Afero Custom CryptoAuthentication Device; Manufacturer: Microchip / Atmel; item_number: E-ICS-00072-00; Supplier 1: Digi-Key; Supplier Part Number 1: ATECC508A-MAHDA-TCT-ND; Stock 1: 4638; Pricing 1: 1=0.35, 25=0.32, 100=0.29 (USD); Mount: Surface Mount; Min Operating Temperature: -40°C; Max Operating Temperature: 85°C; Packaging: Tape and Reel
U3 = XC9264B755MR: Voltage Regulator 0.5A 500KHz Buck; Manufacturer: Torex; item_number: E-ICS-00096-00; Manufacturer Part Number: XC9264B755MR; Package / Case: SOT25
X1 = ABS06-32.768KHZ-T: Crystal, 32.768kHz ±20ppm; Manufacturer: Abracon; Load Capacitance: 12.5pF; ESR (Equivalent Series Resistance): 90kR; Insulation Resistance: 500MR; item_number: E-XTL-00012-00; Supplier 1: Digi-Key; Supplier Part Number 1: 535-10104-1-ND; Manufacturer Part Number: ABS06-32.768KHZ-T; Stock 1: 65982; Pricing 1: 1=1.34, 10=1.277, 50=1.2474, 100=1.0692, 500=1.0395, 1000=0.8762 (USD); Mount: Surface Mount; Case/Package: SMD/SMT; Number of Pins: 2; Min Operating Temperature: -40°C; Max Operating Temperature: 85°C; Frequency: 32.768kHz; Frequency Tolerance: 20ppm; Packaging: Tape and Reel; Tolerance: 20ppm; Package Quantity: 3000; Termination: SMD/SMT; Series Resistance: 90kR; Frequency Stability: 20ppm; Length: 2mm; Height: 0.024inch; Width: 1.2mm; Depth: 1.2mm; Radiation Hardening: No; REACH SVHC: No SVHC; Lead Free: Lead Free; ComponentLink1URL: http://www.farnell.com/datasheets/1796520.pdf; ComponentLink1Description: http://www.farnell.com/datasheets/1796520.pdf; ComponentLink2URL: https://abracon.com/Support/PackageDrawing/Resonators/ABS06.PDF; ComponentLink2Description: https://abracon.com/Support/PackageDrawing/Resonators/ABS06.PDF; ComponentLink3URL: http://www.farnell.com/datasheets/1912788.pdf; ComponentLink3Description: http://www.farnell.com/datasheets/1912788.pdf; ComponentLink4URL: http://www.abracon.com/Resonators/ABS06.pdf; ComponentLink4Description: http://www.abracon.com/Resonators/ABS06.pdf

## Assembly variants
ASR-2DF - Solder Down Module FF: not fitted C5 D2 D3 D11 D12 D13 D14 D15 D16 FB1 FB2 J4 J5 Q3 Q4 Q5 R9 R10 R17 R18 R19 R20 R28 R29 R31 R32 TP8 TP9
ASR-2DF - Connectorized Appliance FF: not fitted C5 D2 D3 D11 D12 D13 D14 J4 R6 R9 R10 R17 R18 R19 R20 TP8 TP9